# Altium project LimeSDR-X3_1v0.PrjPcb (part 11 of 19)

## Sheet 22_LMS2_TX_BB_DACs.SchDoc: LMS2 TX BB DACs
size A3; Organization: Lime Microsystems; Address1: Surrey Tech Centre; Address2: Guildford GU2 7YG; Address3: Surrey; Address4: United Kingdom; Revision: v1.0; SheetNumber: 22; SheetTotal: 31
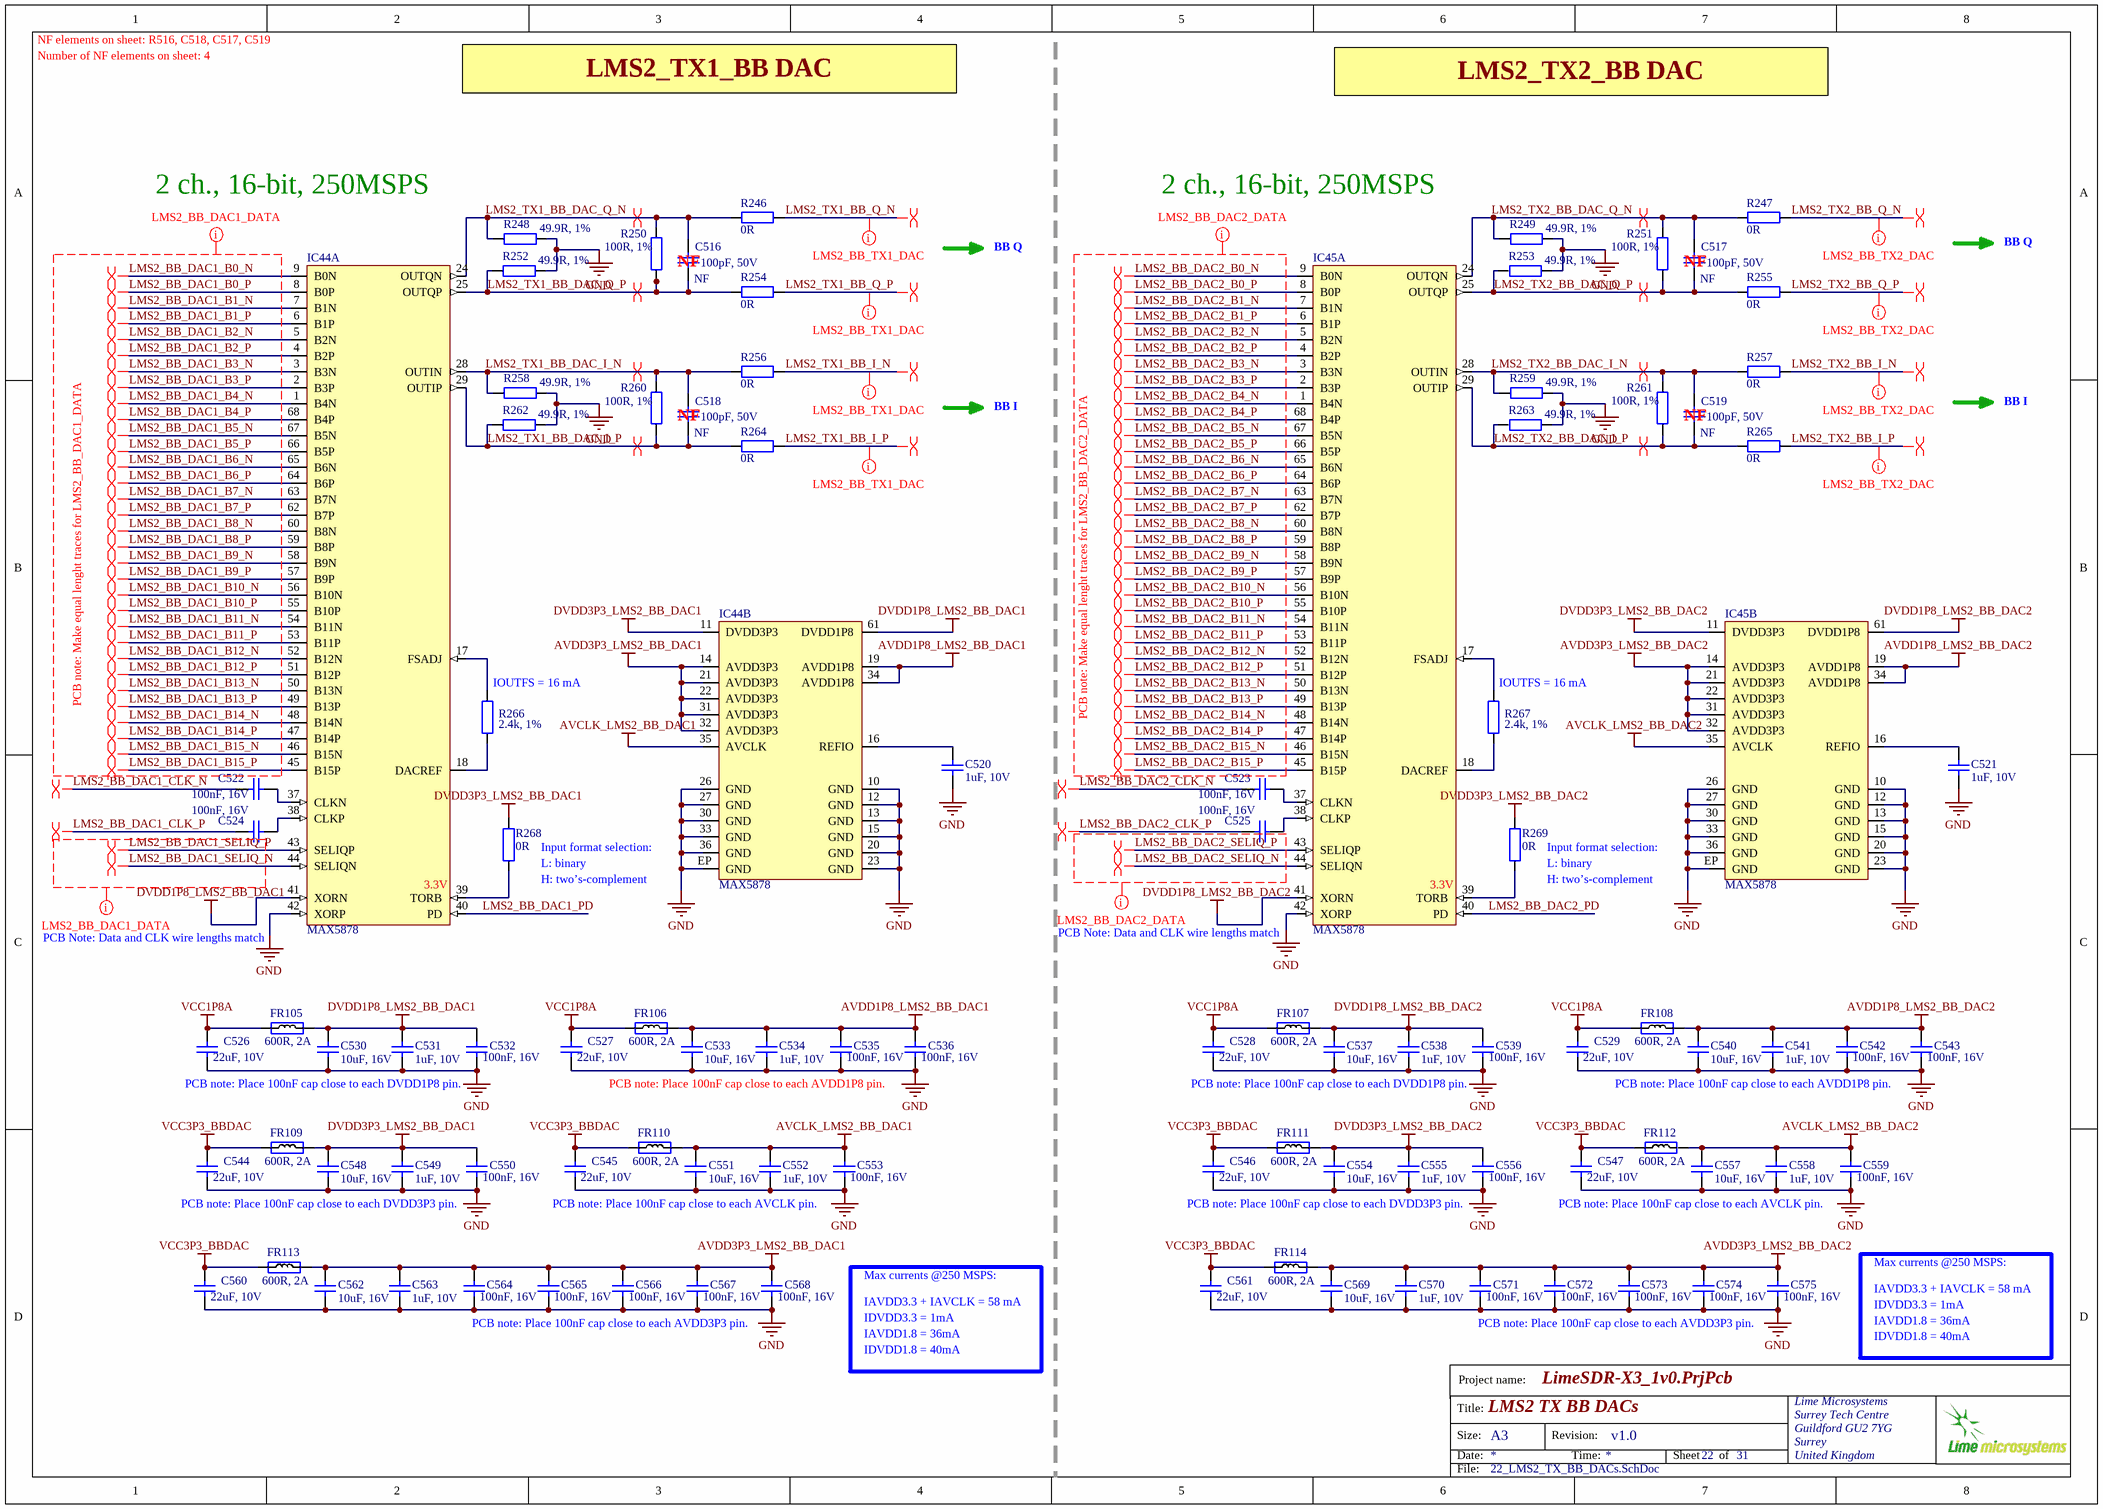
[diagram p21: 22_LMS2_TX_BB_DACs.SchDoc]

### Parts
C516  100pF, 50V  Assembly Info: NF  [CAP0402]
C517  100pF, 50V  Assembly Info: NF  [CAP0402]
C518  100pF, 50V  Assembly Info: NF  [CAP0402]
C519  100pF, 50V  Assembly Info: NF  [CAP0402]
C520  1uF, 10V  [CAP0402]
C521  1uF, 10V  [CAP0402]
C522  100nF, 16V  [CAP0402]
C523  100nF, 16V  [CAP0402]
C524  100nF, 16V  [CAP0402]
C525  100nF, 16V  [CAP0402]
C526  22uF, 10V  [CAP0603]
C527  22uF, 10V  [CAP0603]
C528  22uF, 10V  [CAP0603]
C529  22uF, 10V  [CAP0603]
C530  10uF, 16V  [CAP0603]
C531  1uF, 10V  [CAP0402]
C532  100nF, 16V  [CAP0402]
C533  10uF, 16V  [CAP0603]
C534  1uF, 10V  [CAP0402]
C535  100nF, 16V  [CAP0402]
C536  100nF, 16V  [CAP0402]
C537  10uF, 16V  [CAP0603]
C538  1uF, 10V  [CAP0402]
C539  100nF, 16V  [CAP0402]
C540  10uF, 16V  [CAP0603]
C541  1uF, 10V  [CAP0402]
C542  100nF, 16V  [CAP0402]
C543  100nF, 16V  [CAP0402]
C544  22uF, 10V  [CAP0603]
C545  22uF, 10V  [CAP0603]
C546  22uF, 10V  [CAP0603]
C547  22uF, 10V  [CAP0603]
C548  10uF, 16V  [CAP0603]
C549  1uF, 10V  [CAP0402]
C550  100nF, 16V  [CAP0402]
C551  10uF, 16V  [CAP0603]
C552  1uF, 10V  [CAP0402]
C553  100nF, 16V  [CAP0402]
C554  10uF, 16V  [CAP0603]
C555  1uF, 10V  [CAP0402]
C556  100nF, 16V  [CAP0402]
C557  10uF, 16V  [CAP0603]
C558  1uF, 10V  [CAP0402]
C559  100nF, 16V  [CAP0402]
C560  22uF, 10V  [CAP0603]
C561  22uF, 10V  [CAP0603]
C562  10uF, 16V  [CAP0603]
C563  1uF, 10V  [CAP0402]
C564  100nF, 16V  [CAP0402]
C565  100nF, 16V  [CAP0402]
C566  100nF, 16V  [CAP0402]
C567  100nF, 16V  [CAP0402]
C568  100nF, 16V  [CAP0402]
C569  10uF, 16V  [CAP0603]
C570  1uF, 10V  [CAP0402]
C571  100nF, 16V  [CAP0402]
C572  100nF, 16V  [CAP0402]
C573  100nF, 16V  [CAP0402]
C574  100nF, 16V  [CAP0402]
C575  100nF, 16V  [CAP0402]
FR105  600R, 2A  [RES0805]
FR106  600R, 2A  [RES0805]
FR107  600R, 2A  [RES0805]
FR108  600R, 2A  [RES0805]
FR109  600R, 2A  [RES0805]
FR110  600R, 2A  [RES0805]
FR111  600R, 2A  [RES0805]
FR112  600R, 2A  [RES0805]
FR113  600R, 2A  [RES0805]
FR114  600R, 2A  [RES0805]
IC44  MAX5878  [MAX5878_QFN68]  (parts A,B of 2)
IC45  MAX5878  [MAX5878_QFN68]  (parts A,B of 2)
R246  0R  [RES0402]
R247  0R  [RES0402]
R248  49.9R, 1%  [RES0402]
R249  49.9R, 1%  [RES0402]
R250  100R, 1%  [RES0402]
R251  100R, 1%  [RES0402]
R252  49.9R, 1%  [RES0402]
R253  49.9R, 1%  [RES0402]
R254  0R  [RES0402]
R255  0R  [RES0402]
R256  0R  [RES0402]
R257  0R  [RES0402]
R258  49.9R, 1%  [RES0402]
R259  49.9R, 1%  [RES0402]
R260  100R, 1%  [RES0402]
R261  100R, 1%  [RES0402]
R262  49.9R, 1%  [RES0402]
R263  49.9R, 1%  [RES0402]
R264  0R  [RES0402]
R265  0R  [RES0402]
R266  2.4k, 1%  [RES0402]
R267  2.4k, 1%  [RES0402]
R268  0R  [RES0402]
R269  0R  [RES0402]

### Nets
AVCLK_LMS2_BB_DAC1: C551.2 C552.2 C553.2 FR110.2 IC44.35(AVCLK)
AVCLK_LMS2_BB_DAC2: C557.2 C558.2 C559.2 FR112.2 IC45.35(AVCLK)
AVDD1P8_LMS2_BB_DAC1: C533.2 C534.2 C535.2 C536.2 FR106.2 IC44.19(AVDD1P8) IC44.34(AVDD1P8)
AVDD1P8_LMS2_BB_DAC2: C540.2 C541.2 C542.2 C543.2 FR108.2 IC45.19(AVDD1P8) IC45.34(AVDD1P8)
AVDD3P3_LMS2_BB_DAC1: C562.2 C563.2 C564.2 C565.2 C566.2 C567.2 C568.2 FR113.2 IC44.14(AVDD3P3) IC44.21(AVDD3P3) IC44.22(AVDD3P3) IC44.31(AVDD3P3) IC44.32(AVDD3P3)
AVDD3P3_LMS2_BB_DAC2: C569.2 C570.2 C571.2 C572.2 C573.2 C574.2 C575.2 FR114.2 IC45.14(AVDD3P3) IC45.21(AVDD3P3) IC45.22(AVDD3P3) IC45.31(AVDD3P3) IC45.32(AVDD3P3)
DVDD1P8_LMS2_BB_DAC1: C530.2 C531.2 C532.2 FR105.2 IC44.41(XORN) IC44.61(DVDD1P8)
DVDD1P8_LMS2_BB_DAC2: C537.2 C538.2 C539.2 FR107.2 IC45.41(XORN) IC45.61(DVDD1P8)
DVDD3P3_LMS2_BB_DAC1: C548.2 C549.2 C550.2 FR109.2 IC44.11(DVDD3P3) R268.2
DVDD3P3_LMS2_BB_DAC2: C554.2 C555.2 C556.2 FR111.2 IC45.11(DVDD3P3) R269.2
GND: C520.1 C521.1 C526.1 C527.1 C528.1 C529.1 C530.1 C531.1 C532.1 C533.1 C534.1 C535.1 C536.1 C537.1 C538.1 C539.1 C540.1 C541.1 C542.1 C543.1 C544.1 C545.1 C546.1 C547.1 C548.1 C549.1 C550.1 C551.1 C552.1 C553.1 C554.1 C555.1 C556.1 C557.1 C558.1 C559.1 C560.1 C561.1 C562.1 C563.1 C564.1 C565.1 C566.1 C567.1 C568.1 C569.1 C570.1 C571.1 C572.1 C573.1 C574.1 C575.1 IC44.10(GND) IC44.12(GND) IC44.13(GND) IC44.15(GND) IC44.20(GND) IC44.23(GND) IC44.26(GND) IC44.27(GND) IC44.30(GND) IC44.33(GND) IC44.36(GND) IC44.42(XORP) IC44.EP(GND) IC45.10(GND) IC45.12(GND) IC45.13(GND) IC45.15(GND) IC45.20(GND) IC45.23(GND) IC45.26(GND) IC45.27(GND) IC45.30(GND) IC45.33(GND) IC45.36(GND) IC45.42(XORP) IC45.EP(GND) R248.1 R249.1 R252.1 R253.1 R258.1 R259.1 R262.1 R263.1
VCC1P8A: C526.2 C527.2 C528.2 C529.2 FR105.1 FR106.1 FR107.1 FR108.1
VCC3P3_BBDAC: C544.2 C545.2 C546.2 C547.2 C560.2 C561.2 FR109.1 FR110.1 FR111.1 FR112.1 FR113.1 FR114.1
LMS2_BB_DAC1_B0_N: IC44.9(B0N)
LMS2_BB_DAC1_B0_P: IC44.8(B0P)
LMS2_BB_DAC1_B1_N: IC44.7(B1N)
LMS2_BB_DAC1_B1_P: IC44.6(B1P)
LMS2_BB_DAC1_B2_N: IC44.5(B2N)
LMS2_BB_DAC1_B2_P: IC44.4(B2P)
LMS2_BB_DAC1_B3_N: IC44.3(B3N)
LMS2_BB_DAC1_B3_P: IC44.2(B3P)
LMS2_BB_DAC1_B4_N: IC44.1(B4N)
LMS2_BB_DAC1_B4_P: IC44.68(B4P)
LMS2_BB_DAC1_B5_N: IC44.67(B5N)
LMS2_BB_DAC1_B5_P: IC44.66(B5P)
LMS2_BB_DAC1_B6_N: IC44.65(B6N)
LMS2_BB_DAC1_B6_P: IC44.64(B6P)
LMS2_BB_DAC1_B7_N: IC44.63(B7N)
LMS2_BB_DAC1_B7_P: IC44.62(B7P)
LMS2_BB_DAC1_B8_N: IC44.60(B8N)
LMS2_BB_DAC1_B8_P: IC44.59(B8P)
LMS2_BB_DAC1_B9_N: IC44.58(B9N)
LMS2_BB_DAC1_B9_P: IC44.57(B9P)
LMS2_BB_DAC1_B10_N: IC44.56(B10N)
LMS2_BB_DAC1_B10_P: IC44.55(B10P)
LMS2_BB_DAC1_B11_N: IC44.54(B11N)
LMS2_BB_DAC1_B11_P: IC44.53(B11P)
LMS2_BB_DAC1_B12_N: IC44.52(B12N)
LMS2_BB_DAC1_B12_P: IC44.51(B12P)
LMS2_BB_DAC1_B13_N: IC44.50(B13N)
LMS2_BB_DAC1_B13_P: IC44.49(B13P)
LMS2_BB_DAC1_B14_N: IC44.48(B14N)
LMS2_BB_DAC1_B14_P: IC44.47(B14P)
LMS2_BB_DAC1_B15_N: IC44.46(B15N)
LMS2_BB_DAC1_B15_P: IC44.45(B15P)
LMS2_BB_DAC1_CLK_N: C522.2
LMS2_BB_DAC1_CLK_P: C524.2
LMS2_BB_DAC1_PD: IC44.40(PD)
LMS2_BB_DAC1_SELIQ_N: IC44.44(SELIQN)
LMS2_BB_DAC1_SELIQ_P: IC44.43(SELIQP)
LMS2_BB_DAC2_B0_N: IC45.9(B0N)
LMS2_BB_DAC2_B0_P: IC45.8(B0P)
LMS2_BB_DAC2_B1_N: IC45.7(B1N)
LMS2_BB_DAC2_B1_P: IC45.6(B1P)
LMS2_BB_DAC2_B2_N: IC45.5(B2N)
LMS2_BB_DAC2_B2_P: IC45.4(B2P)
LMS2_BB_DAC2_B3_N: IC45.3(B3N)
LMS2_BB_DAC2_B3_P: IC45.2(B3P)
LMS2_BB_DAC2_B4_N: IC45.1(B4N)
LMS2_BB_DAC2_B4_P: IC45.68(B4P)
LMS2_BB_DAC2_B5_N: IC45.67(B5N)
LMS2_BB_DAC2_B5_P: IC45.66(B5P)
LMS2_BB_DAC2_B6_N: IC45.65(B6N)
LMS2_BB_DAC2_B6_P: IC45.64(B6P)
LMS2_BB_DAC2_B7_N: IC45.63(B7N)
LMS2_BB_DAC2_B7_P: IC45.62(B7P)
LMS2_BB_DAC2_B8_N: IC45.60(B8N)
LMS2_BB_DAC2_B8_P: IC45.59(B8P)
LMS2_BB_DAC2_B9_N: IC45.58(B9N)
LMS2_BB_DAC2_B9_P: IC45.57(B9P)
LMS2_BB_DAC2_B10_N: IC45.56(B10N)
LMS2_BB_DAC2_B10_P: IC45.55(B10P)
LMS2_BB_DAC2_B11_N: IC45.54(B11N)
LMS2_BB_DAC2_B11_P: IC45.53(B11P)
LMS2_BB_DAC2_B12_N: IC45.52(B12N)
LMS2_BB_DAC2_B12_P: IC45.51(B12P)
LMS2_BB_DAC2_B13_N: IC45.50(B13N)
LMS2_BB_DAC2_B13_P: IC45.49(B13P)
LMS2_BB_DAC2_B14_N: IC45.48(B14N)
LMS2_BB_DAC2_B14_P: IC45.47(B14P)
LMS2_BB_DAC2_B15_N: IC45.46(B15N)
LMS2_BB_DAC2_B15_P: IC45.45(B15P)
LMS2_BB_DAC2_CLK_N: C523.2
LMS2_BB_DAC2_CLK_P: C525.2
LMS2_BB_DAC2_PD: IC45.40(PD)
LMS2_BB_DAC2_SELIQ_N: IC45.44(SELIQN)
LMS2_BB_DAC2_SELIQ_P: IC45.43(SELIQP)
LMS2_TX1_BB_DAC_I_N: C518.1 IC44.28(OUTIN) R256.1 R258.2 R260.1
LMS2_TX1_BB_DAC_I_P: C518.2 IC44.29(OUTIP) R260.2 R262.2 R264.1
LMS2_TX1_BB_DAC_Q_N: C516.1 IC44.24(OUTQN) R246.1 R248.2 R250.1
LMS2_TX1_BB_DAC_Q_P: C516.2 IC44.25(OUTQP) R250.2 R252.2 R254.1
LMS2_TX1_BB_I_N: R256.2
LMS2_TX1_BB_I_P: R264.2
LMS2_TX1_BB_Q_N: R246.2
LMS2_TX1_BB_Q_P: R254.2
LMS2_TX2_BB_DAC_I_N: C519.1 IC45.28(OUTIN) R257.1 R259.2 R261.1
LMS2_TX2_BB_DAC_I_P: C519.2 IC45.29(OUTIP) R261.2 R263.2 R265.1
LMS2_TX2_BB_DAC_Q_N: C517.1 IC45.24(OUTQN) R247.1 R249.2 R251.1
LMS2_TX2_BB_DAC_Q_P: C517.2 IC45.25(OUTQP) R251.2 R253.2 R255.1
LMS2_TX2_BB_I_N: R257.2
LMS2_TX2_BB_I_P: R265.2
LMS2_TX2_BB_Q_N: R247.2
LMS2_TX2_BB_Q_P: R255.2
NetC520_2: C520.2 IC44.16(REFIO)
NetC521_2: C521.2 IC45.16(REFIO)
NetC522_1: C522.1 IC44.37(CLKN)
NetC523_1: C523.1 IC45.37(CLKN)
NetC524_1: C524.1 IC44.38(CLKP)
NetC525_1: C525.1 IC45.38(CLKP)
NetIC44_17: IC44.17(FSADJ) R266.2
NetIC44_18: IC44.18(DACREF) R266.1
NetIC44_39: IC44.39(TORB) R268.1
NetIC45_17: IC45.17(FSADJ) R267.2
NetIC45_18: IC45.18(DACREF) R267.1
NetIC45_39: IC45.39(TORB) R269.1

### Layout directives
differential pair: LMS2_BB_DAC1_B0_N, LMS2_BB_DAC1_B0_P, LMS2_BB_DAC1_B1_N, LMS2_BB_DAC1_B1_P, LMS2_BB_DAC1_B2_N, LMS2_BB_DAC1_B2_P, LMS2_BB_DAC1_B3_N, LMS2_BB_DAC1_B3_P, LMS2_BB_DAC1_B4_N, LMS2_BB_DAC1_B4_P, LMS2_BB_DAC1_B5_N, LMS2_BB_DAC1_B5_P, LMS2_BB_DAC1_B6_N, LMS2_BB_DAC1_B6_P, LMS2_BB_DAC1_B7_N, LMS2_BB_DAC1_B7_P, LMS2_BB_DAC1_B8_N, LMS2_BB_DAC1_B8_P, LMS2_BB_DAC1_B9_N, LMS2_BB_DAC1_B9_P, LMS2_BB_DAC1_B10_N, LMS2_BB_DAC1_B10_P, LMS2_BB_DAC1_B11_N, LMS2_BB_DAC1_B11_P, LMS2_BB_DAC1_B12_N, LMS2_BB_DAC1_B12_P, LMS2_BB_DAC1_B13_N, LMS2_BB_DAC1_B13_P, LMS2_BB_DAC1_B14_N, LMS2_BB_DAC1_B14_P, LMS2_BB_DAC1_B15_N, LMS2_BB_DAC1_B15_P, LMS2_BB_DAC1_CLK_N, LMS2_BB_DAC1_CLK_P, LMS2_BB_DAC1_SELIQ_N, LMS2_BB_DAC1_SELIQ_P, LMS2_BB_DAC2_B0_N, LMS2_BB_DAC2_B0_P, LMS2_BB_DAC2_B1_N, LMS2_BB_DAC2_B1_P, LMS2_BB_DAC2_B2_N, LMS2_BB_DAC2_B2_P, LMS2_BB_DAC2_B3_N, LMS2_BB_DAC2_B3_P, LMS2_BB_DAC2_B4_N, LMS2_BB_DAC2_B4_P, LMS2_BB_DAC2_B5_N, LMS2_BB_DAC2_B5_P, LMS2_BB_DAC2_B6_N, LMS2_BB_DAC2_B6_P, LMS2_BB_DAC2_B7_N, LMS2_BB_DAC2_B7_P, LMS2_BB_DAC2_B8_N, LMS2_BB_DAC2_B8_P, LMS2_BB_DAC2_B9_N, LMS2_BB_DAC2_B9_P, LMS2_BB_DAC2_B10_N, LMS2_BB_DAC2_B10_P, LMS2_BB_DAC2_B11_N, LMS2_BB_DAC2_B11_P, LMS2_BB_DAC2_B12_N, LMS2_BB_DAC2_B12_P, LMS2_BB_DAC2_B13_N, LMS2_BB_DAC2_B13_P, LMS2_BB_DAC2_B14_N, LMS2_BB_DAC2_B14_P, LMS2_BB_DAC2_B15_N, LMS2_BB_DAC2_B15_P, LMS2_BB_DAC2_CLK_N, LMS2_BB_DAC2_CLK_P, LMS2_BB_DAC2_SELIQ_N, LMS2_BB_DAC2_SELIQ_P, LMS2_TX1_BB_DAC_I_N, LMS2_TX1_BB_DAC_I_P, LMS2_TX1_BB_DAC_Q_N, LMS2_TX1_BB_DAC_Q_P, LMS2_TX1_BB_I_N, LMS2_TX1_BB_I_P, LMS2_TX1_BB_Q_N, LMS2_TX1_BB_Q_P, LMS2_TX2_BB_DAC_I_N, LMS2_TX2_BB_DAC_I_P, LMS2_TX2_BB_DAC_Q_N, LMS2_TX2_BB_DAC_Q_P, LMS2_TX2_BB_I_N, LMS2_TX2_BB_I_P, LMS2_TX2_BB_Q_N, LMS2_TX2_BB_Q_P
net class LMS2_BB_DAC1_DATA: LMS2_BB_DAC1_B0_N, LMS2_BB_DAC1_B0_P, LMS2_BB_DAC1_B1_N, LMS2_BB_DAC1_B1_P, LMS2_BB_DAC1_B2_N, LMS2_BB_DAC1_B2_P, LMS2_BB_DAC1_B3_N, LMS2_BB_DAC1_B3_P, LMS2_BB_DAC1_B4_N, LMS2_BB_DAC1_B4_P, LMS2_BB_DAC1_B5_N, LMS2_BB_DAC1_B5_P, LMS2_BB_DAC1_B6_N, LMS2_BB_DAC1_B6_P, LMS2_BB_DAC1_B7_N, LMS2_BB_DAC1_B7_P, LMS2_BB_DAC1_B8_N, LMS2_BB_DAC1_B8_P, LMS2_BB_DAC1_B9_N, LMS2_BB_DAC1_B9_P, LMS2_BB_DAC1_B10_N, LMS2_BB_DAC1_B10_P, LMS2_BB_DAC1_B11_N, LMS2_BB_DAC1_B11_P, LMS2_BB_DAC1_B12_N, LMS2_BB_DAC1_B12_P, LMS2_BB_DAC1_B13_N, LMS2_BB_DAC1_B13_P, LMS2_BB_DAC1_B14_N, LMS2_BB_DAC1_B14_P, LMS2_BB_DAC1_B15_N, LMS2_BB_DAC1_B15_P, LMS2_BB_DAC1_SELIQ_N, LMS2_BB_DAC1_SELIQ_P
net class LMS2_BB_DAC2_DATA: LMS2_BB_DAC2_B0_N, LMS2_BB_DAC2_B0_P, LMS2_BB_DAC2_B1_N, LMS2_BB_DAC2_B1_P, LMS2_BB_DAC2_B2_N, LMS2_BB_DAC2_B2_P, LMS2_BB_DAC2_B3_N, LMS2_BB_DAC2_B3_P, LMS2_BB_DAC2_B4_N, LMS2_BB_DAC2_B4_P, LMS2_BB_DAC2_B5_N, LMS2_BB_DAC2_B5_P, LMS2_BB_DAC2_B6_N, LMS2_BB_DAC2_B6_P, LMS2_BB_DAC2_B7_N, LMS2_BB_DAC2_B7_P, LMS2_BB_DAC2_B8_N, LMS2_BB_DAC2_B8_P, LMS2_BB_DAC2_B9_N, LMS2_BB_DAC2_B9_P, LMS2_BB_DAC2_B10_N, LMS2_BB_DAC2_B10_P, LMS2_BB_DAC2_B11_N, LMS2_BB_DAC2_B11_P, LMS2_BB_DAC2_B12_N, LMS2_BB_DAC2_B12_P, LMS2_BB_DAC2_B13_N, LMS2_BB_DAC2_B13_P, LMS2_BB_DAC2_B14_N, LMS2_BB_DAC2_B14_P, LMS2_BB_DAC2_B15_N, LMS2_BB_DAC2_B15_P, LMS2_BB_DAC2_SELIQ_N, LMS2_BB_DAC2_SELIQ_P
net class LMS2_BB_TX2_DAC: LMS2_TX2_BB_I_N, LMS2_TX2_BB_I_P, LMS2_TX2_BB_Q_N, LMS2_TX2_BB_Q_P
net class LMS2_BB_TX1_DAC: LMS2_TX1_BB_I_N, LMS2_TX1_BB_I_P, LMS2_TX1_BB_Q_N, LMS2_TX1_BB_Q_P

### Notes on the sheet
- NF elements on sheet: R516, C518, C517, C519
- Number of NF elements on sheet: 4
- LMS2_TX1_BB DAC
- LMS2_TX2_BB DAC
- (near R248) 2 ch., 16-bit, 250MSPS
- BB Q
- (near R249) 2 ch., 16-bit, 250MSPS
- (near C516) NF
- (near C517) NF
- (near C518) NF
- BB I
- (near C519) NF
- PCB note: Make equal lenght traces for LMS2_BB_DAC1_DATA
- (near R266) IOUTFS = 16 mA
- PCB note: Make equal lenght traces for LMS2_BB_DAC2_DATA
- (near R267) IOUTFS = 16 mA
- Input format selection:
- (near IC44) 3.3V
- (near R268) L: binary
- (near R268) H: two’s-complement
- (near IC45) 3.3V
- (near R269) L: binary
- (near R269) H: two’s-complement
- (near IC44) PCB Note: Data and CLK wire lengths match
- (near IC45) PCB Note: Data and CLK wire lengths match
- PCB note: Place 100nF cap close to each DVDD1P8 pin.
- PCB note: Place 100nF cap close to each AVDD1P8 pin.
- PCB note: Place 100nF cap close to each DVDD3P3 pin.
- PCB note: Place 100nF cap close to each AVCLK pin.
- PCB note: Place 100nF cap close to each AVDD3P3 pin.
- IAVDD3.3 + IAVCLK = 58 mA
- IDVDD3.3 = 1mA
- Max currents @250 MSPS:
- IAVDD1.8 = 36mA
- IDVDD1.8 = 40mA
- Project name:
- Title:
- Size:
- Date:
- A3
- Revision:
- Time:
- Sheet
- of
- File:

### Library data of the parts
C516-C519 = Cap_0402: Manufacturer Part Number 1: CC0402JRNPO9BN101; Manufacturer: Yageo; Part Description: 100pF ±5% 50V C0G, NP0 Ceramic Capacitor -55°C ~ 125°C Surface Mount, MLCC 0402 (1005 Metric) 0.039" L x 0.020" W (1.00mm x 0.50mm); Tolerance: ±5%; Temperature Coefficient: C0G, NP0; Value: 100pF, 50V; Capacitance: 100pF; Thickness (Max): 0.022" (0.55mm); Size / Dimension: 0.039" L x 0.020" W (1.00mm x 0.50mm); RoHS: RoHS Compliant; Ratings: -; Package / Case: 0402 (1005 Metric); Mounting Type: Surface Mount, MLCC; Height - Seated (Max): -; Features: -; Lead Spacing: -; Voltage - Rated: 50V; Operating Temperature: -55°C ~ 125°C; Packaging: Cut Tape (CT); Applications: General Purpose; Lead Style: -; Supplier 1: Digi-Key; Category: Capacitors; Supplier Part Number 1: 311-1024-1-ND
C520 C521 C531 C534 C538 C541 C549 C552 C555 C558 C563 C570 = Cap_0402: Manufacturer Part Number 1: C1005X5R1E105K050BC; Manufacturer: TDK; Part Description: 1µF ±10% 10V X5R Ceramic Capacitor -55°C ~ 85°C Surface Mount, MLCC 0402 (1005 Metric) 0.039" L x 0.020" W (1.00mm x 0.50mm); Voltage Rating: 10; Capacitance Tolerance: ± 10%; Product Range: TDK - C Series; Ceramic Capacitor Case: 0402 [1005 Metric]; Capacitance: 1; Dielectric Characteristic: X6; Value: 1uF, 10V; Supplier 1: Digi-Key; Supplier Part Number 1: 445-9066-1-ND; MSL: -; RoHS: YES
C522-C525 C532 C535 C536 C539 C542 C543 C550 C553 C556 C559 C564-C568 C571-C575 = Cap_0603: Part Description: 0.10µF ±10% 16V X7R Ceramic Capacitor -55°C ~ 125°C Surface Mount, MLCC 0402 (1005 Metric) 0.039" L x 0.020" W (1.00mm x 0.50mm); Manufacturer Part Number 1: GRM155R71C104KA88D; Brand: Murata Electronics; Tolerance: 10 %; Type: General Purpose MLCC; Capacitance: 0.1 uF; Temperature Coefficient / Code: +/- 15 %; Case Height: 0.5 mm; Case Length: 1 mm; Dielectric: X7R; Supplier 1: Mouser; Supplier Part Number 1: 81-GRM155R71C104KA88; Case Code - in: 0402; Manufacturer: Murata Electronics; Category: Multilayer Ceramic Capacitors MLCC - SMD/SMT; Voltage Rating DC: 16 V; Value: 100nF, 16V; Case Code - mm: 1005; Case Width: 0.5 mm; Maximum Operating Temperature: + 125 C; Minimum Operating Temperature: - 55 C; Minimum Order Quantity: 1; Operating Temperature Range: - 55 C to + 125 C; Package / Case: 0402 (1005 metric); Packaging: Reel; Product: General Type MLCCs; Product Category: Low & Medium Capacitance SMD Ceramic Chip Capacitors; Reeling: True; RoHS - Mouser: Y; RoHS: RoHS Compliant; Series: GRM; Standard Pack Qty: 10000; Termination Style: SMD/SMT
C526-C529 C544-C547 C560 C561 = Cap_0603: Manufacturer Part Number 1: C1608X5R1A226M080AC; Part Description: 22µF ±20% 10V Ceramic Capacitor X5R 0603 (1608 Metric); Manufacturer: TDK Corporation; Brand: TDK; Temperature Coefficient / Code: +/- 15 %; Tolerance: 20 %; Type: Multilayer Ceramic Chip Capacitor; Supplier 1: Mouser; Supplier Part Number 1: 810-C1608X5R1A226M; Package / Case: 0603 (1608 metric); Category: Multilayer Ceramic Capacitors MLCC - SMD/SMT; Capacitance: 22 uF; Operating Temperature Range: - 55 C to + 85 C; Case Code - in: 0603; Voltage Rating DC: 10 V; Case Code - mm: 1608; Value: 22uF, 10V
C530 C533 C537 C540 C548 C551 C554 C557 C562 C569 = Cap_0603: Manufacturer: Yageo; Manufacturer Part Number 1: GRM188R61C106MA73D; Part Description: 10µF ±20% 16V Ceramic Capacitor X5R 0603 (1608 Metric); Temperature Coefficient: X5R; Capacitance: 10µF; Tolerance: ±20%; Value: 10uF, 16V; Supplier 1: Digi-Key; Supplier Part Number 1: 490-7201-2-ND; Category: Capacitors; Ratings: -; Features: -; Lead Style: -; Package / Case: 0603 (1608 Metric); Lead Spacing: -; Applications: General Purpose; Voltage - Rated: 16V; Operating Temperature: -55°C ~ 85°C; Thickness (Max): 0.039" (1.00mm); Mounting Type: Surface Mount, MLCC; RoHS: RoHS Compliant; Size / Dimension: 0.063" L x 0.031" W (1.60mm x 0.80mm); Packaging: Tape & Reel (TR); Height - Seated (Max): -
FR105-FR114 = Ferrite: Manufacturer Part Number 1: MPZ2012S601AT000; Manufacturer: TDK Corporation; Part Description: FERRITE BEAD 600 OHM 0805 1LN; Filter Type: Differential Mode - Single; Impedance @ Frequency: 600 Ohm @ 100MHz; DC Resistance (DCR): 100 mOhm Max; Supplier 1: Digi-Key; Supplier Part Number 1: 445-2206-2-ND; Mounting Type: Surface Mount; RoHS: RoHS Compliant; Height (Max): 0.041" (1.05mm); Packaging: Tape & Reel (TR); Category: Filters; Current Rating: 2A; Package / Case: 0805 (2012 Metric); Size / Dimension: 0.079" L x 0.049" W (2.00mm x 1.25mm); Value: 600R, 2A
IC44 IC45 = MAX5878EGK: Part Description: 16 Bit Digital to Analog Converter 2 68-QFN-EP (10x10); Manufacturer: Maxim; Manufacturer Part Number 1: MAX5878EGK+D; Max Power Dissipation: 331mW; Number of DAC Channels: 2; Max Supply Voltage: 3.465V; Min Supply Voltage: 3.135V; Interface: Parallel,LVDS; Settling Time: 14ns; Number of Bits: 16; Sampling Rate: 250000000S/s; Resolution: 16b; Supply Type: Analog,Digital; Conversion Rate: 250MS/s; Integral Nonlinearity (INL): 3LSB; Supplier 1: Digi-Key; Supplier Part Number 1: MAX5878EGK+D-ND; Stock 1: 52; Pricing 1: 1=23,84000, 10=21,99000, 25=21,00200, 100=20,44800 (USD); RoHS: Yes; Mount: Surface Mount; Case/Package: QFN; Number of Pins: 68; Min Operating Temperature: -40°C; Max Operating Temperature: 85°C; Packaging: Rail/Tube; Package Quantity: 30; Number of Converters: 2; Radiation Hardening: No; REACH SVHC: Unknown; ComponentLink1URL: https://datasheet.ciiva.com/1399/max5878-1399152.pdf?src-supplier=Digi-Key; ComponentLink1Description: https://datasheet.ciiva.com/1399/max5878-1399152.pdf?src-supplier=Digi-Key; ComponentLink2URL: https://datasheet.ciiva.com/16604/max5878-16604848.pdf?src-supplier=Avnet+Europe; ComponentLink2Description: https://datasheet.ciiva.com/16604/max5878-16604848.pdf?src-supplier=Avnet+Europe; ComponentLink3URL: https://datasheet.ciiva.com/12285/max5878-106739-12285938.pdf?src-supplier=Mouser; ComponentLink3Description: https://datasheet.ciiva.com/12285/max5878-106739-12285938.pdf?src-supplier=Mouser; ComponentLink4URL: https://datasheet.ciiva.com/26805/max5878egk-d-26805730.pdf?src-supplier=IIIC; ComponentLink4Description: https://datasheet.ciiva.com/26805/max5878egk-d-26805730.pdf?src-supplier=IIIC; ComponentLink5URL: https://datasheet.ciiva.com/14250/max5878-14250858.pdf?src-supplier=Avnet; ComponentLink5Description: https://datasheet.ciiva.com/14250/max5878-14250858.pdf?src-supplier=Avnet
R246 R247 R254-R257 R264 R265 R268 R269 = Res_0402: Manufacturer Part Number 1: RC0402JR-070RL; Manufacturer: Yageo; Part Description: RES SMD 0.0OHM JUMPER 1/16W 0402; Resistance (Ohms): 0.0; Tolerance: Jumper; Power (Watts): 0.063W, 1/16W; Value: 0R; Supplier 1: Digi-Key; Supplier Part Number 1: 311-0.0JRTR-ND; Category: Resistors; Temperature Coefficient: -; Features: Moisture Resistant; Supplier Device Package: 0402; Height: 0.016" (0.40mm); Package / Case: 0402 (1005 Metric); Operating Temperature: -55°C ~ 155°C; Size / Dimension: 0.039" L x 0.020" W (1.00mm x 0.50mm); Composition: Thick Film; Packaging: Tape & Reel (TR); Number of Terminations: 2; RoHS: RoHS Compliant
R248 R249 R252 R253 R258 R259 R262 R263 = Res_0402: Manufacturer: Samsung Electro-Mechanics America, Inc.; Part Description: RES SMD 49.9 OHM 1% 1/16W 0402; Manufacturer Part Number 1: RC1005F49R9CS; Temperature Coefficient: ±100ppm/°C; Resistance (Ohms): 49.9; Power (Watts): 0.063W, 1/16W; Number of Terminations: 2; Size / Dimension: 0.039" L x 0.020" W (1.00mm x 0.50mm); Supplier Device Package: 0402 (1005 Metric); RoHS: RoHS Compliant; Supplier Part Number 1: 1276-3469-6-ND; Features: -; Packaging: Digi-Reel®; Tolerance: ±1%; Height: 0.016" (0.40mm); Category: Resistors; Composition: Thick Film; Package / Case: 0402 (1005 Metric); Supplier 1: Digi-Key; Operating Temperature: -55°C ~ 155°C; Value: 49.9R, 1%
R250 R251 R260 R261 = Res_0402: Manufacturer Part Number 1: RMCF0402FT100R; Manufacturer: Stackpole Electronics Inc.; Part Description: RES SMD 100 OHM 1% 1/16W 0402; Power (Watts): 0.063W, 1/16W; Temperature Coefficient: ±100ppm/°C; Resistance (Ohms): 100; Value: 100R, 1%; Supplier 1: Digi-Key; Supplier Part Number 1: RMCF0402FT100RDKR-ND; Packaging: Digi-Reel®; Composition: Thick Film; Number of Terminations: 2; Package / Case: 0402 (1005 Metric); RoHS: RoHS Compliant; Category: Resistors; Size / Dimension: 0.039" L x 0.020" W (1.00mm x 0.50mm); Tolerance: ±1%; Supplier Device Package: 0402; Features: -; Height: 0.016" (0.40mm); Operating Temperature: -55°C ~ 155°C
R266 R267 = Res_0402: Manufacturer Part Number 1: RC0402FR-072K4L; Manufacturer: Yageo; Part Description: 2.4 kOhms ±1% 0.063W, 1/16W Chip Resistor 0402 (1005 Metric) Moisture Resistant Thick Film; Temperature Coefficient: ±100ppm/°C; Power (Watts): 0.063W, 1/16W; Value: 2.4k, 1%; Package / Case: 0402 (1005 Metric); RoHS: RoHS Compliant; Supplier Part Number 1: 311-2.40KLRCT-ND; Resistance (Ohms): 2.4k; Size / Dimension: 0.039" L x 0.020" W (1.00mm x 0.50mm); Category: Resistors; Part Status: Active; Features: Moisture Resistant; Supplier Device Package: 0402; Failure Rate: -; Tolerance: ±1%; Composition: Thick Film; Packaging: Cut Tape (CT); Operating Temperature: -55°C ~ 155°C; Height - Seated (Max): 0.016" (0.40mm); Supplier 1: Digi-Key

## Sheet 23_LMS2_RX1_BB_ADC.SchDoc: LMS2 RX1 BB ADC
size A3; Organization: Lime Microsystems; Address1: Surrey Tech Centre; Address2: Guildford GU2 7YG; Address3: Surrey; Address4: United Kingdom; Revision: v1.0; SheetNumber: 23; SheetTotal: 31
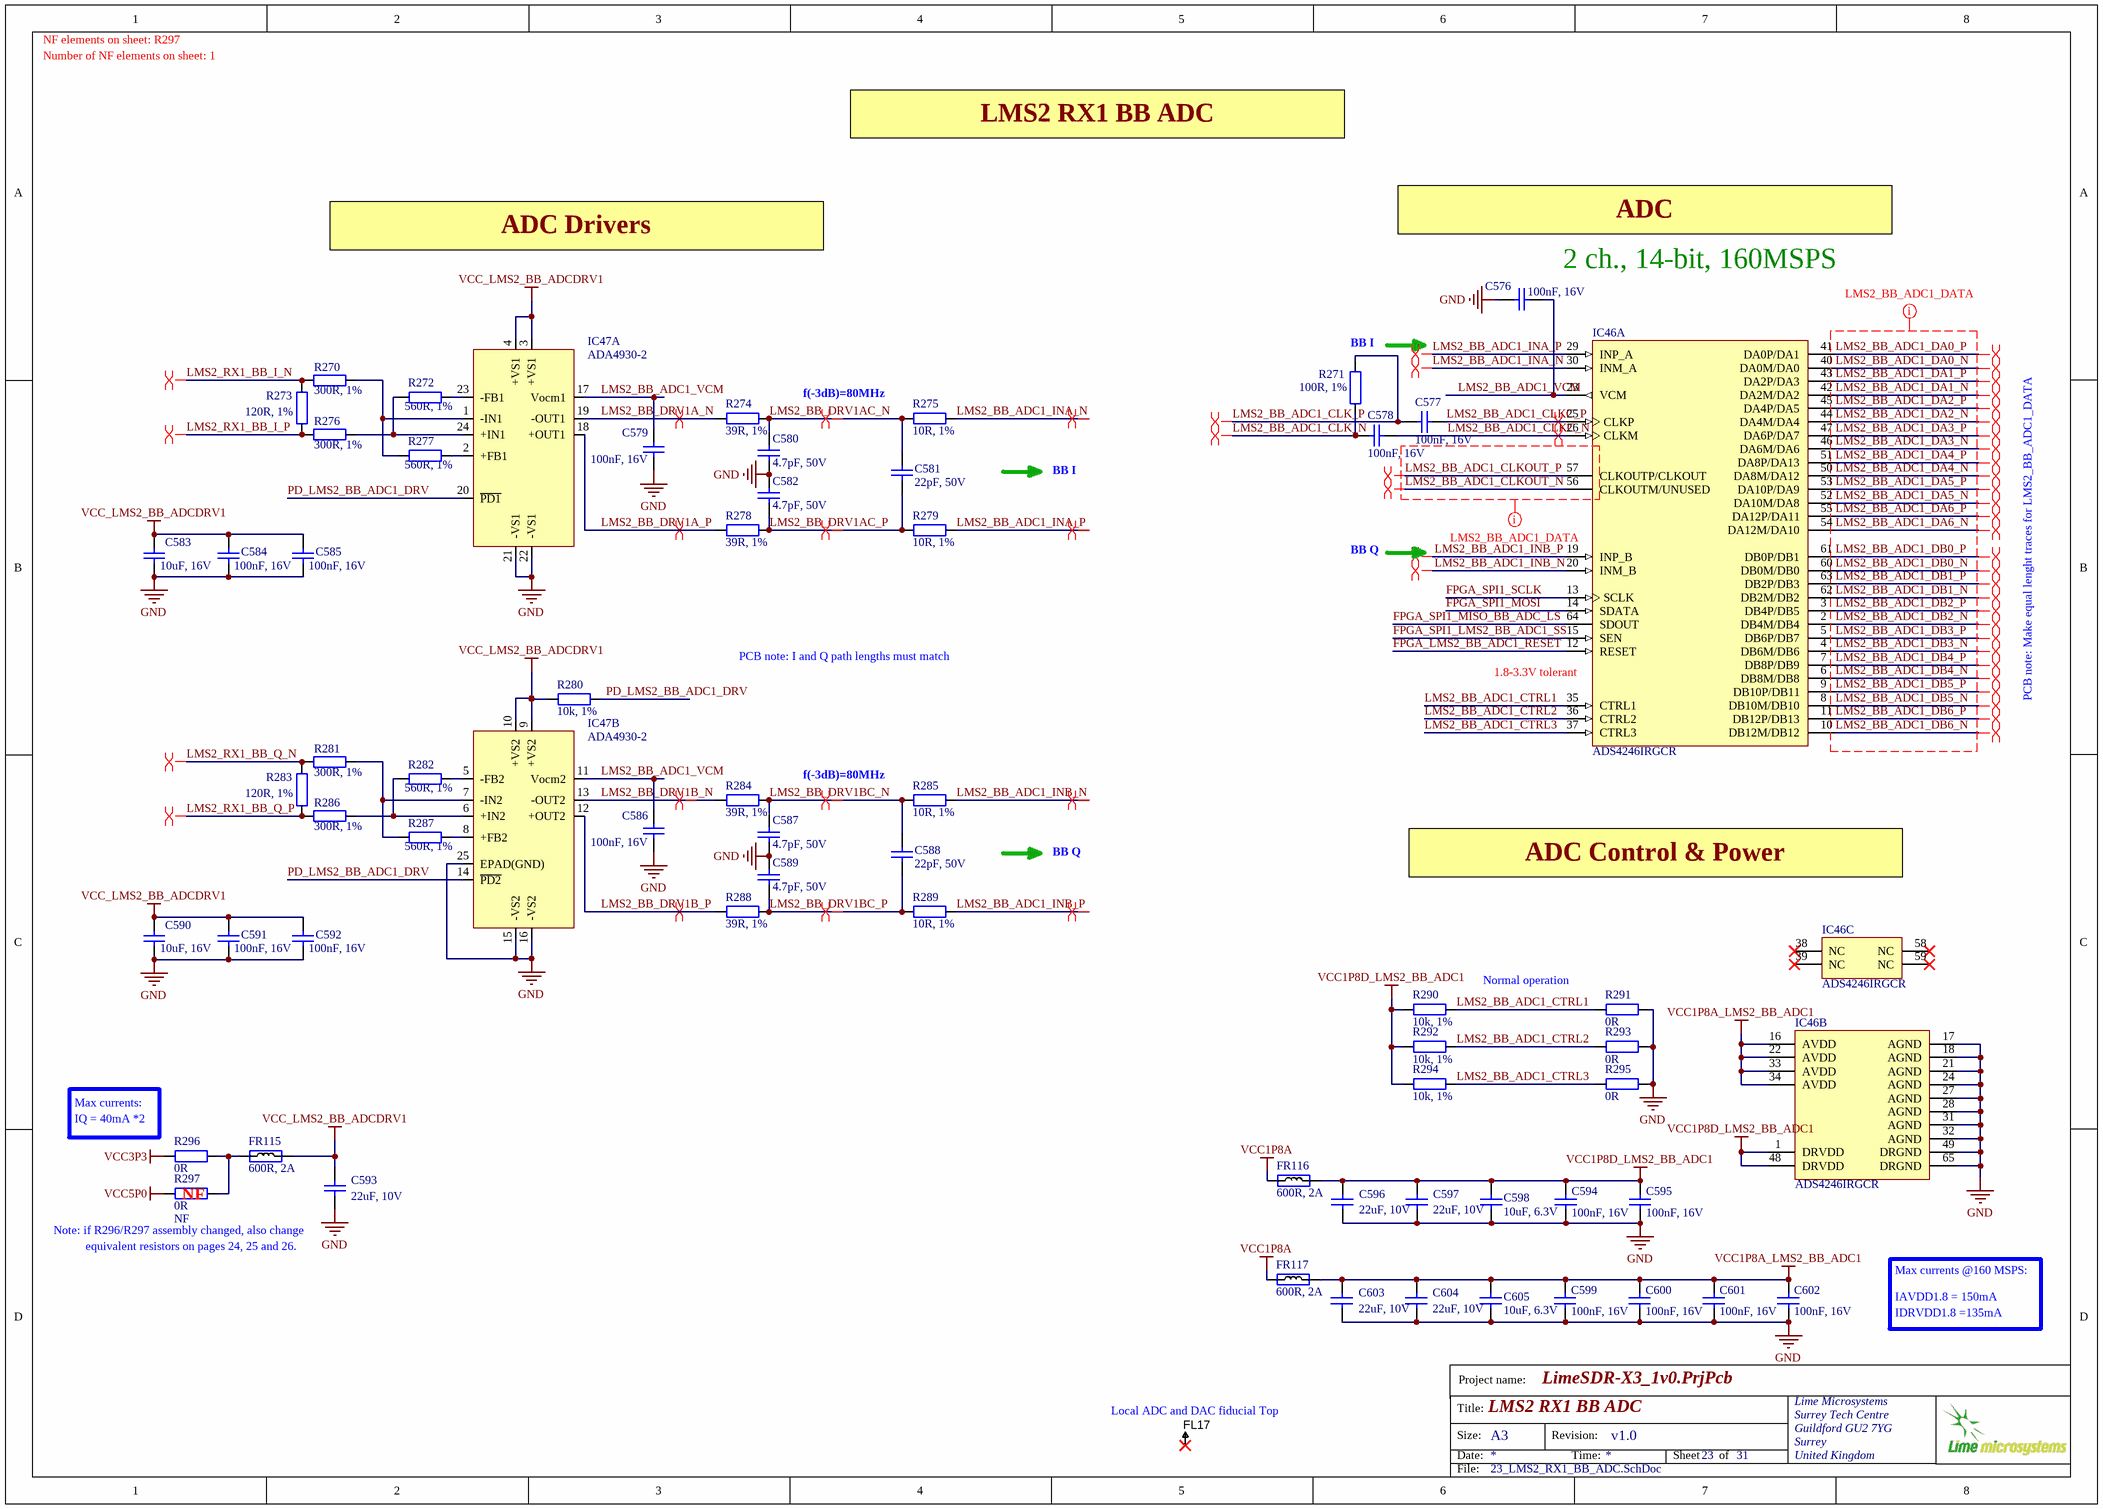
[diagram p22: 23_LMS2_RX1_BB_ADC.SchDoc]

### Parts
C576  100nF, 16V  [CAP0402]
C577  100nF, 16V  [CAP0402]
C578  100nF, 16V  [CAP0402]
C579  100nF, 16V  [CAP0402]
C580  4.7pF, 50V  [CAP0402]
C581  22pF, 50V  [CAP0402]
C582  4.7pF, 50V  [CAP0402]
C583  10uF, 16V  [CAP0603]
C584  100nF, 16V  [CAP0402]
C585  100nF, 16V  [CAP0402]
C586  100nF, 16V  [CAP0402]
C587  4.7pF, 50V  [CAP0402]
C588  22pF, 50V  [CAP0402]
C589  4.7pF, 50V  [CAP0402]
C590  10uF, 16V  [CAP0603]
C591  100nF, 16V  [CAP0402]
C592  100nF, 16V  [CAP0402]
C593  22uF, 10V  [CAP0603]
C594  100nF, 16V  [CAP0402]
C595  100nF, 16V  [CAP0402]
C596  22uF, 10V  [CAP0603]
C597  22uF, 10V  [CAP0603]
C598  10uF, 6.3V  [CAP0603]
C599  100nF, 16V  [CAP0402]
C600  100nF, 16V  [CAP0402]
C601  100nF, 16V  [CAP0402]
C602  100nF, 16V  [CAP0402]
C603  22uF, 10V  [CAP0603]
C604  22uF, 10V  [CAP0603]
C605  10uF, 6.3V  [CAP0603]
FL17  Fiducial  [Fiducial_local]  (value not drawn)
FR115  600R, 2A  [RES0805]
FR116  600R, 2A  [RES0805]
FR117  600R, 2A  [RES0805]
IC46  ADS4246IRGCR  [TI-RGC64-7400X7400TP_V]  (parts A,B,C of 3)
IC47  ADA4930-2  [ADA4930-2_LFCSP-24]  (parts A,B of 2)
R270  300R, 1%  [RES0402]
R271  100R, 1%  [RES0402]
R272  560R, 1%  [RES0402]
R273  120R, 1%  [RES0402]
R274  39R, 1%  [RES0402]
R275  10R, 1%  [RES0402]
R276  300R, 1%  [RES0402]
R277  560R, 1%  [RES0402]
R278  39R, 1%  [RES0402]
R279  10R, 1%  [RES0402]
R280  10k, 1%  [RES0402]
R281  300R, 1%  [RES0402]
R282  560R, 1%  [RES0402]
R283  120R, 1%  [RES0402]
R284  39R, 1%  [RES0402]
R285  10R, 1%  [RES0402]
R286  300R, 1%  [RES0402]
R287  560R, 1%  [RES0402]
R288  39R, 1%  [RES0402]
R289  10R, 1%  [RES0402]
R290  10k, 1%  [RES0402]
R291  0R  [RES0402]
R292  10k, 1%  [RES0402]
R293  0R  [RES0402]
R294  10k, 1%  [RES0402]
R295  0R  [RES0402]
R296  0R  [RES0402]
R297  0R  Assembly Info: NF  [RES0402]

### Nets
GND: C576.1 C579.2 C580.2 C582.1 C583.1 C584.2 C585.2 C586.2 C587.2 C589.1 C590.1 C591.2 C592.2 C593.1 C594.1 C595.1 C596.1 C597.1 C598.2 C599.1 C600.1 C601.1 C602.1 C603.1 C604.1 C605.2 IC46.17(AGND) IC46.18(AGND) IC46.21(AGND) IC46.24(AGND) IC46.27(AGND) IC46.28(AGND) IC46.31(AGND) IC46.32(AGND) IC46.49(DRGND) IC46.65(DRGND) IC47.15(-VS2) IC47.16(-VS2) IC47.21(-VS1) IC47.22(-VS1) IC47.25(EPAD(GND)) R291.1 R293.1 R295.1
VCC1P8A: FR116.1 FR117.1
VCC1P8A_LMS2_BB_ADC1: C599.2 C600.2 C601.2 C602.2 C603.2 C604.2 C605.1 FR117.2 IC46.16(AVDD) IC46.22(AVDD) IC46.33(AVDD) IC46.34(AVDD)
VCC1P8D_LMS2_BB_ADC1: C594.2 C595.2 C596.2 C597.2 C598.1 FR116.2 IC46.1(DRVDD) IC46.48(DRVDD) R290.2 R292.2 R294.2
VCC3P3: R296.2
VCC5P0: R297.2
VCC_LMS2_BB_ADCDRV1: C583.2 C584.1 C585.1 C590.2 C591.1 C592.1 C593.2 FR115.2 IC47.3(+VS1) IC47.4(+VS1) IC47.9(+VS2) IC47.10(+VS2) R280.2
FPGA_LMS2_BB_ADC1_RESET: IC46.12(RESET)
FPGA_SPI1_LMS2_BB_ADC1_SS: IC46.15(SEN)
FPGA_SPI1_MISO_BB_ADC_LS: IC46.64(SDOUT)
FPGA_SPI1_MOSI: IC46.14(SDATA)
FPGA_SPI1_SCLK: IC46.13(SCLK)
LMS2_BB_ADC1_CLK_N: C578.2 R271.1
LMS2_BB_ADC1_CLK_P: C577.2 R271.2
LMS2_BB_ADC1_CLKC_N: C578.1 IC46.26(CLKM)
LMS2_BB_ADC1_CLKC_P: C577.1 IC46.25(CLKP)
LMS2_BB_ADC1_CLKOUT_N: IC46.56(CLKOUTM/UNUSED)
LMS2_BB_ADC1_CLKOUT_P: IC46.57(CLKOUTP/CLKOUT)
LMS2_BB_ADC1_CTRL1: IC46.35(CTRL1) R290.1 R291.2
LMS2_BB_ADC1_CTRL2: IC46.36(CTRL2) R292.1 R293.2
LMS2_BB_ADC1_CTRL3: IC46.37(CTRL3) R294.1 R295.2
LMS2_BB_ADC1_DA0_N: IC46.40(DA0M/DA0)
LMS2_BB_ADC1_DA0_P: IC46.41(DA0P/DA1)
LMS2_BB_ADC1_DA1_N: IC46.42(DA2M/DA2)
LMS2_BB_ADC1_DA1_P: IC46.43(DA2P/DA3)
LMS2_BB_ADC1_DA2_N: IC46.44(DA4M/DA4)
LMS2_BB_ADC1_DA2_P: IC46.45(DA4P/DA5)
LMS2_BB_ADC1_DA3_N: IC46.46(DA6M/DA6)
LMS2_BB_ADC1_DA3_P: IC46.47(DA6P/DA7)
LMS2_BB_ADC1_DA4_N: IC46.50(DA8M/DA12)
LMS2_BB_ADC1_DA4_P: IC46.51(DA8P/DA13)
LMS2_BB_ADC1_DA5_N: IC46.52(DA10M/DA8)
LMS2_BB_ADC1_DA5_P: IC46.53(DA10P/DA9)
LMS2_BB_ADC1_DA6_N: IC46.54(DA12M/DA10)
LMS2_BB_ADC1_DA6_P: IC46.55(DA12P/DA11)
LMS2_BB_ADC1_DB0_N: IC46.60(DB0M/DB0)
LMS2_BB_ADC1_DB0_P: IC46.61(DB0P/DB1)
LMS2_BB_ADC1_DB1_N: IC46.62(DB2M/DB2)
LMS2_BB_ADC1_DB1_P: IC46.63(DB2P/DB3)
LMS2_BB_ADC1_DB2_N: IC46.2(DB4M/DB4)
LMS2_BB_ADC1_DB2_P: IC46.3(DB4P/DB5)
LMS2_BB_ADC1_DB3_N: IC46.4(DB6M/DB6)
LMS2_BB_ADC1_DB3_P: IC46.5(DB6P/DB7)
LMS2_BB_ADC1_DB4_N: IC46.6(DB8M/DB8)
LMS2_BB_ADC1_DB4_P: IC46.7(DB8P/DB9)
LMS2_BB_ADC1_DB5_N: IC46.8(DB10M/DB10)
LMS2_BB_ADC1_DB5_P: IC46.9(DB10P/DB11)
LMS2_BB_ADC1_DB6_N: IC46.10(DB12M/DB12)
LMS2_BB_ADC1_DB6_P: IC46.11(DB12P/DB13)
LMS2_BB_ADC1_INA_N: IC46.30(INM_A) R275.1
LMS2_BB_ADC1_INA_P: IC46.29(INP_A) R279.1
LMS2_BB_ADC1_INB_N: IC46.20(INM_B) R285.1
LMS2_BB_ADC1_INB_P: IC46.19(INP_B) R289.1
LMS2_BB_ADC1_VCM: C576.2 C579.1 C586.1 IC46.23(VCM) IC47.11(Vocm2) IC47.17(Vocm1)
LMS2_BB_DRV1A_N: IC47.19(-OUT1) R274.2
LMS2_BB_DRV1A_P: IC47.18(+OUT1) R278.2
LMS2_BB_DRV1AC_N: C580.1 C581.1 R274.1 R275.2
LMS2_BB_DRV1AC_P: C581.2 C582.2 R278.1 R279.2
LMS2_BB_DRV1B_N: IC47.13(-OUT2) R284.2
LMS2_BB_DRV1B_P: IC47.12(+OUT2) R288.2
LMS2_BB_DRV1BC_N: C587.1 C588.1 R284.1 R285.2
LMS2_BB_DRV1BC_P: C588.2 C589.2 R288.1 R289.2
LMS2_RX1_BB_I_N: R270.2 R273.2
LMS2_RX1_BB_I_P: R273.1 R276.2
LMS2_RX1_BB_Q_N: R281.2 R283.2
LMS2_RX1_BB_Q_P: R283.1 R286.2
PD_LMS2_BB_ADC1_DRV: IC47.14(~{PD2}) IC47.20(~{PD1}) R280.1
NetFR115_1: FR115.1 R296.1 R297.1
NetIC47_1: IC47.1(-IN1) R270.1 R277.2
NetIC47_2: IC47.2(+FB1) R277.1
NetIC47_5: IC47.5(-FB2) R282.1
NetIC47_6: IC47.6(+IN2) R282.2 R286.1
NetIC47_7: IC47.7(-IN2) R281.1 R287.2
NetIC47_8: IC47.8(+FB2) R287.1
NetIC47_23: IC47.23(-FB1) R272.1
NetIC47_24: IC47.24(+IN1) R272.2 R276.1

Not connected (* = marked no-connect by the designer): FL17 1*; IC46 38(NC)* 39(NC)* 58(NC)* 59(NC)*

### Layout directives
net class LMS2_BB_ADC1_DATA: LMS2_BB_ADC1_CLKOUT_N, LMS2_BB_ADC1_CLKOUT_P, LMS2_BB_ADC1_DA0_N, LMS2_BB_ADC1_DA0_P, LMS2_BB_ADC1_DA1_N, LMS2_BB_ADC1_DA1_P, LMS2_BB_ADC1_DA2_N, LMS2_BB_ADC1_DA2_P, LMS2_BB_ADC1_DA3_N, LMS2_BB_ADC1_DA3_P, LMS2_BB_ADC1_DA4_N, LMS2_BB_ADC1_DA4_P, LMS2_BB_ADC1_DA5_N, LMS2_BB_ADC1_DA5_P, LMS2_BB_ADC1_DA6_N, LMS2_BB_ADC1_DA6_P, LMS2_BB_ADC1_DB0_N, LMS2_BB_ADC1_DB0_P, LMS2_BB_ADC1_DB1_N, LMS2_BB_ADC1_DB1_P, LMS2_BB_ADC1_DB2_N, LMS2_BB_ADC1_DB2_P, LMS2_BB_ADC1_DB3_N, LMS2_BB_ADC1_DB3_P, LMS2_BB_ADC1_DB4_N, LMS2_BB_ADC1_DB4_P, LMS2_BB_ADC1_DB5_N, LMS2_BB_ADC1_DB5_P, LMS2_BB_ADC1_DB6_N, LMS2_BB_ADC1_DB6_P
differential pair: LMS2_BB_ADC1_CLK_N, LMS2_BB_ADC1_CLK_P, LMS2_BB_ADC1_CLKC_N, LMS2_BB_ADC1_CLKC_P, LMS2_BB_ADC1_CLKOUT_N, LMS2_BB_ADC1_CLKOUT_P, LMS2_BB_ADC1_DA0_N, LMS2_BB_ADC1_DA0_P, LMS2_BB_ADC1_DA1_N, LMS2_BB_ADC1_DA1_P, LMS2_BB_ADC1_DA2_N, LMS2_BB_ADC1_DA2_P, LMS2_BB_ADC1_DA3_N, LMS2_BB_ADC1_DA3_P, LMS2_BB_ADC1_DA4_N, LMS2_BB_ADC1_DA4_P, LMS2_BB_ADC1_DA5_N, LMS2_BB_ADC1_DA5_P, LMS2_BB_ADC1_DA6_N, LMS2_BB_ADC1_DA6_P, LMS2_BB_ADC1_DB0_N, LMS2_BB_ADC1_DB0_P, LMS2_BB_ADC1_DB1_N, LMS2_BB_ADC1_DB1_P, LMS2_BB_ADC1_DB2_N, LMS2_BB_ADC1_DB2_P, LMS2_BB_ADC1_DB3_N, LMS2_BB_ADC1_DB3_P, LMS2_BB_ADC1_DB4_N, LMS2_BB_ADC1_DB4_P, LMS2_BB_ADC1_DB5_N, LMS2_BB_ADC1_DB5_P, LMS2_BB_ADC1_DB6_N, LMS2_BB_ADC1_DB6_P, LMS2_BB_ADC1_INA_N, LMS2_BB_ADC1_INA_P, LMS2_BB_ADC1_INB_N, LMS2_BB_ADC1_INB_P, LMS2_BB_DRV1A_N, LMS2_BB_DRV1A_P, LMS2_BB_DRV1AC_N, LMS2_BB_DRV1AC_P, LMS2_BB_DRV1B_N, LMS2_BB_DRV1B_P, LMS2_BB_DRV1BC_N, LMS2_BB_DRV1BC_P, LMS2_RX1_BB_I_N, LMS2_RX1_BB_I_P, LMS2_RX1_BB_Q_N, LMS2_RX1_BB_Q_P

### Notes on the sheet
- NF elements on sheet: R297
- Number of NF elements on sheet: 1
- LMS2 RX1 BB ADC
- ADC Drivers
- ADC
- (near C576) 2 ch., 14-bit, 160MSPS
- (near R271) BB I
- f(-3dB)=80MHz
- BB I
- BB Q
- PCB note: I and Q path lengths must match
- (near IC46) 1.8-3.3V tolerant
- PCB note: Make equal lenght traces for LMS2_BB_ADC1_DATA
- ADC Control & Power
- Normal operation
- (near R296) IQ = 40mA *2
- (near R296) Max currents:
- Note: if R296/R297 assembly changed, also change
- equivalent resistors on pages 24, 25 and 26.
- (near R297) NF
- IAVDD1.8 = 150mA
- IDRVDD1.8 =135mA
- Max currents @160 MSPS:
- (near FL17) Local ADC and DAC fiducial Top
- Project name:
- Title:
- Size:
- Date:
- A3
- Revision:
- Time:
- Sheet
- of
- File:

### Library data of the parts
C576-C579 C586 C594 C595 C599-C602 = Cap_0603: as C522-C525 on sheet 22_LMS2_TX_BB_DACs; Supplier 1: Mouser; Supplier Part Number 1: 81-GRM155R71C104KA88; Case Code - in: 0402; Manufacturer: Murata Electronics; Category: Multilayer Ceramic Capacitors MLCC - SMD/SMT; Voltage Rating DC: 16 V; Value: 100nF, 16V; Case Code - mm: 1005; Case Width: 0.5 mm; Maximum Operating Temperature: + 125 C; Minimum Operating Temperature: - 55 C; Minimum Order Quantity: 1; Operating Temperature Range: - 55 C to + 125 C; Package / Case: 0402 (1005 metric); Packaging: Reel; Product: General Type MLCCs; Product Category: Low & Medium Capacitance SMD Ceramic Chip Capacitors; Reeling: True; RoHS - Mouser: Y; RoHS: RoHS Compliant; Series: GRM; Standard Pack Qty: 10000; Termination Style: SMD/SMT
C580 C582 C587 C589 = Cap_0402: Manufacturer: MURATA; Manufacturer Part Number 1: GRM1555C1H4R7CA01D; Part Description: 4.7pF ±0.25pF 50V Ceramic Capacitor C0G, NP0 0402 (1005 Metric); Capacitance Tolerance: ± 0.25; Voltage Rating: 50; Dielectric Characteristic: C0G / NP0; Ceramic Capacitor Case: 0402 [1005 Metric]; Capacitance: 4.7; SVHC: No SVHC (15-Jun-2015; Product Range: GRM Series; Value: 4.7pF, 50V; Supplier 1: Farnell; Supplier Part Number 1: 2434644; Operating Temperature Max: 125; Operating Temperature Min: -55; MSL: MSL 1 - Unlimited; RoHS: YES; Packaging: Cut Tape
C581 C588 = Cap_0402: Manufacturer: Yageo; Manufacturer Part Number 1: CC0402JRNPO9BN220; Part Description: 22pF ±5% 50V C0G, NP0 Ceramic Capacitor -55°C ~ 125°C Surface Mount, MLCC 0402 (1005 Metric) 0.039" L x 0.020" W (1.00mm x 0.50mm); Tolerance: ±5%; Temperature Coefficient: C0G, NP0; Value: 22pF, 50V; Supplier 1: Digi-Key; Supplier Part Number 1: 311-1018-2-ND; Category: Capacitors; Voltage - Rated: 50V; Packaging: Tape & Reel (TR); RoHS: RoHS Compliant; Capacitance: 22pF; Operating Temperature: -55°C ~ 125°C; Mounting Type: Surface Mount, MLCC; Height - Seated (Max): -; Size / Dimension: 0.039" L x 0.020" W (1.00mm x 0.50mm); Ratings: -; Applications: General Purpose; Thickness (Max): 0.022" (0.55mm); Lead Spacing: -; Lead Style: -; Features: -; Package / Case: 0402 (1005 Metric)
C583 C590 = Cap_0603: as C530 on sheet 22_LMS2_TX_BB_DACs; Value: 10uF, 16V; Supplier 1: Digi-Key; Supplier Part Number 1: 490-7201-2-ND; Category: Capacitors; Ratings: -; Features: -; Lead Style: -; Package / Case: 0603 (1608 Metric); Lead Spacing: -; Applications: General Purpose; Voltage - Rated: 16V; Operating Temperature: -55°C ~ 85°C; Thickness (Max): 0.039" (1.00mm); Mounting Type: Surface Mount, MLCC; RoHS: RoHS Compliant; Size / Dimension: 0.063" L x 0.031" W (1.60mm x 0.80mm); Packaging: Tape & Reel (TR); Height - Seated (Max): -
C584 C585 C591 C592 = Cap_0603: Manufacturer Part Number 1: GRM155R71C104KA88D; Part Description: 0.10µF ±10% 16V X7R Ceramic Capacitor -55°C ~ 125°C Surface Mount, MLCC 0402 (1005 Metric) 0.039" L x 0.020" W (1.00mm x 0.50mm); Brand: Murata Electronics; Tolerance: 10 %; Type: General Purpose MLCC; Capacitance: 0.1 uF; Temperature Coefficient / Code: +/- 15 %; Case Height: 0.5 mm; Case Length: 1 mm; Dielectric: X7R; Supplier 1: Mouser; Supplier Part Number 1: 81-GRM155R71C104KA88; Case Code - in: 0402; Manufacturer: Murata Electronics; Category: Multilayer Ceramic Capacitors MLCC - SMD/SMT; Voltage Rating DC: 16 V; Value: 100nF, 16V; Case Code - mm: 1005; Case Width: 0.5 mm; Maximum Operating Temperature: + 125 C; Minimum Operating Temperature: - 55 C; Minimum Order Quantity: 1; Operating Temperature Range: - 55 C to + 125 C; Package / Case: 0402 (1005 metric); Packaging: Reel; Product: General Type MLCCs; Product Category: Low & Medium Capacitance SMD Ceramic Chip Capacitors; Reeling: True; RoHS - Mouser: Y; RoHS: RoHS Compliant; Series: GRM; Standard Pack Qty: 10000; Termination Style: SMD/SMT
C593 C596 C597 C603 C604 = Cap_0603: as C526 on sheet 22_LMS2_TX_BB_DACs; Supplier 1: Mouser; Supplier Part Number 1: 810-C1608X5R1A226M; Package / Case: 0603 (1608 metric); Category: Multilayer Ceramic Capacitors MLCC - SMD/SMT; Capacitance: 22uF; Operating Temperature Range: - 55 C to + 85 C; Case Code - in: 0603; Voltage Rating DC: 10 V; Case Code - mm: 1608; Value: 22uF, 10V
C598 C605 = Cap_0603: Manufacturer Part Number 1: CC0603MRX5R5BB106; Part Description: 10µF ±20% 6.3V X5R Ceramic Capacitor -55°C ~ 85°C Surface Mount, MLCC 0603 (1608 Metric) 0.063" L x 0.031" W (1.60mm x 0.80mm); Manufacturer: Yageo; Capacitance: 10µF; Tolerance: ±20%; Supplier 1: Digi-Key; Supplier Part Number 1: 311-1448-2-ND; Package / Case: 0603 (1608 Metric); Category: Capacitors; Voltage - Rated: 6.3V; Value: 10uF, 6.3V
FR115 = Ferrite: as FR105-FR114 on sheet 22_LMS2_TX_BB_DACs; Supplier 1: Digi-Key; Supplier Part Number 1: 445-2206-2-ND; Mounting Type: Surface Mount; RoHS: RoHS Compliant; Height (Max): 0.041" (1.05mm); Packaging: Tape & Reel (TR); Category: Filters; Current Rating: 2A; Package / Case: 0805 (2012 Metric); Size / Dimension: 0.079" L x 0.049" W (2.00mm x 1.25mm); Value: 600R, 2A
FR116 FR117 = Ferrite: Manufacturer Part Number 1: MPZ2012S601AT000; Manufacturer: TDK Corporation; Part Description: FERRITE BEAD 600 OHM 0805 1LN; DC Resistance (DCR): 100 mOhm Max; Filter Type: Differential Mode - Single; Impedance @ Frequency: 600 Ohm @ 100MHz; Supplier 1: Digi-Key; Supplier Part Number 1: 445-2206-2-ND; Value: 600R, 2A; Category: Filters; Current Rating: 2A; Height (Max): 0.041" (1.05mm); Mounting Type: Surface Mount; Package / Case: 0805 (2012 Metric); Packaging: Tape & Reel (TR); RoHS: RoHS Compliant; Size / Dimension: 0.079" L x 0.049" W (2.00mm x 1.25mm)
IC46 = ADS4246IRGCR: 14-Bit 160 MSPS Dual Low Power ADC, -40 to 85 degC, 64-pin QFN (RGC64), Green (RoHS & no Sb/Br); Manufacturer: Texas Instruments; Manufacturer Part Number 1: ADS4246IRGCT; Part Description: 14 Bit Analog to Digital Converter 2 Input 2 Pipelined 64-VQFN (9x9); Number of Bits: 14; Sampling Rate (Per Second): 160M; Number of Inputs: 2; Input Type: Differential; Data Interface: LVDS - Parallel, Parallel; Configuration: S/H-ADC; Ratio - S/H:ADC: 1:1; Architecture: Pipelined; Reference Type: Internal; Voltage - Supply, Analog: 1.7 V ~ 1.9 V; Supplier 1: Digi-Key; Supplier Part Number 1: 296-28772-1-ND; RoHS: RoHS Compliant; Category: Integrated Circuits (ICs); Stock 1: 83; Pricing 1: 1=95.91, 10=90.96, 100=82.2967 (USD); Packaging: Cut Tape (CT); Part Status: Active; Number of A/D Converters: 2; Voltage - Supply, Digital: 1.7 V ~ 1.9 V; Features: Simultaneous Sampling; Operating Temperature: -40°C ~ 85°C; Package / Case: 64-VFQFN Exposed Pad; Supplier Device Package: 64-VQFN (9x9); ComponentLink1URL: http://www.ti.com/lit/ds/symlink/ads4246.pdf; ComponentLink1Description: http://www.ti.com/lit/ds/symlink/ads4246.pdf
IC47 = ADA4930-2: Manufacturer: Analog Devices Inc.; Manufacturer Part Number 1: ADA4930-2YCPZ-R7; Part Description: Differential Amplifier 2 Circuit Differential 24-LFCSP-WQ (4x4); Amplifier Type: Differential; Voltage - Supply, Single/Dual (±): 3.3V, 5V; Number of Circuits: 2; Current - Supply: 34mA; Slew Rate: 3400 V/µs; Voltage - Input Offset: 150µV; Current - Input Bias: 23µA; -3db Bandwidth: 1.35GHz; Current - Output / Channel: 30mA; Supplier 1: Digi-Key; Mounting Type: Surface Mount; Gain Bandwidth Product: -; Supplier Device Package: 24-LFCSP-VQ (4x4); Category: Integrated Circuits (ICs); Operating Temperature: -40°C ~ 105°C; Packaging: Cut Tape (CT); RoHS: RoHS Compliant; Package / Case: 24-VFQFN Exposed Pad, CSP; Output Type: Differential; Supplier Part Number 1: ADA4930-2YCPZ-R7CT-ND
R270 R276 R281 R286 = Res_0402: Manufacturer: Vishay Dale; Part Description: RES SMD 300 OHM 1% 1/16W 0402; Manufacturer Part Number 1: CRCW0402300RFKED; Resistance (Ohms): 300; Temperature Coefficient: ±100ppm/°C; Power (Watts): 0.063W, 1/16W; Value: 300R, 1%; Supplier 1: Digi-Key; Supplier Device Package: 0402 (1005 Metric); Composition: Thick Film; Features: Automotive AEC-Q200; Packaging: Cut Tape (CT); Size / Dimension: 0.039" L x 0.020" W (1.00mm x 0.50mm); Category: Resistors; Package / Case: 0402 (1005 Metric); Supplier Part Number 1: 541-300LCT-ND; Number of Terminations: 2; Tolerance: ±1%; Height: 0.016" (0.40mm); Operating Temperature: -55°C ~ 155°C; RoHS: RoHS Compliant
R271 = Res_0402: Manufacturer Part Number 1: RMCF0402FT100R; Part Description: RES SMD 100 OHM 1% 1/16W 0402; Manufacturer: Stackpole Electronics Inc.; Temperature Coefficient: ±100ppm/°C; Supplier 1: Digi-Key; Supplier Part Number 1: RMCF0402FT100RDKR-ND; Package / Case: 0402 (1005 Metric); Composition: Thick Film; Category: Resistors; Tolerance: ±1%; Value: 100R, 1%
R272 R277 R282 R287 = Res_0402: Manufacturer: Vishay Dale; Part Description: RES SMD 560 OHM 1% 1/16W 0402; Manufacturer Part Number 1: CRCW0402560RFKED; Resistance (Ohms): 560; Temperature Coefficient: ±100ppm/°C; Power (Watts): 0.063W, 1/16W; Value: 560R, 1%; Supplier Device Package: 0402 (1005 Metric); Composition: Thick Film; Packaging: Cut Tape (CT); Number of Terminations: 2; Operating Temperature: -55°C ~ 155°C; Supplier Part Number 1: 541-560LCT-ND; Supplier 1: Digi-Key; Category: Resistors; Height: 0.016" (0.40mm); Features: Automotive AEC-Q200; Size / Dimension: 0.039" L x 0.020" W (1.00mm x 0.50mm); Tolerance: ±1%; Package / Case: 0402 (1005 Metric); RoHS: RoHS Compliant
R273 R283 = Res_0402: Manufacturer: Yageo; Manufacturer Part Number 1: RC0402FR-07120RL; Part Description: 120 Ohms ±1% 0.063W, 1/16W Chip Resistor 0402 (1005 Metric) Moisture Resistant Thick Film; Power Rating: 62.5mW; Voltage Rating: 50V; Temperature Coefficient: 100ppm/°C; Max Power Dissipation: 63mW; Value: 120R, 1%; Supplier 1: Digi-Key; Supplier Part Number 1: 311-120LRCT-ND; Stock 1: 1593308; Pricing 1: 1=0.1, 10=0.016, 100=0.0067, 1000=0.00301, 2500=0.00261, 5000=0.00215 (USD); Case/Package: 0402; Case Code (Imperial): 0402; Case Code (Metric): 1005; Min Operating Temperature: -55°C; Max Operating Temperature: 155°C; Package Quantity: 1; Resistance: 120R; Tolerance: 1%; Packaging: Tape and Reel; Termination: SMD/SMT; Composition: Thick Film; Number of Terminations: 2; Military Standard: Not; Features: Moisture Resistant; Length: 1mm; Height: 0.016inch; Width: 0.02inch; Depth: 0.5mm; REACH SVHC: No SVHC; Lead Free: Lead Free; ComponentLink1URL: http://www.farnell.com/datasheets/1018594.pdf?src-supplier=Element14; ComponentLink1Description: http://www.farnell.com/datasheets/1018594.pdf?src-supplier=Element14; ComponentLink2URL: http://www.mouser.com/ds/2/447/PYu-RC0402_51_RoHS_L_6_r-8721.pdf?src-supplier=Mouser; ComponentLink2Description: http://www.mouser.com/ds/2/447/PYu-RC0402_51_RoHS_L_6_r-8721.pdf?src-supplier=Mouser; ComponentLink3URL: http://documents.rs-components.com/techlib://itc_doclist_GB.htm?stockno=6185898&src-supplier=RSComponents; ComponentLink3Description: http://documents.rs-components.com/techlib://itc_doclist_GB.htm?stockno=6185898&src-supplier=RSComponents; ComponentLink4URL: http://www.yageo.com/documents/recent/PYu-RC_Group_51_RoHS_L_10.pdf?src-supplier=Digi-Key; ComponentLink4Description: http://www.yageo.com/documents/recent/PYu-RC_Group_51_RoHS_L_10.pdf?src-supplier=Digi-Key; ComponentLink5URL: http://www.yageo.com/documents/recent/PYu-RC0402_51_RoHS_L_6_r.pdf?src-supplier=Future+Electronics; ComponentLink5Description: http://www.yageo.com/documents/recent/PYu-RC0402_51_RoHS_L_6_r.pdf?src-supplier=Future+Electronics
R274 R278 R284 R288 = Res_0402: Manufacturer: Yageo; Manufacturer Part Number 1: RC0402FR-0739RL; Part Description: 39 Ohms ±1% 0.063W, 1/16W Chip Resistor 0402 (1005 Metric) Moisture Resistant Thick Film; Power Rating: 63mW; Voltage Rating: 50V; Temperature Coefficient: 100ppm/°C; Value: 39R, 1%; ComponentLink1URL: http://www.yageo.com.tw/exep/pages/download/literatures/PYu-R_INT-thick_7.pdf?src-supplier=Digi-Key; ComponentLink1Description: http://www.yageo.com.tw/exep/pages/download/literatures/PYu-R_INT-thick_7.pdf?src-supplier=Digi-Key; ComponentLink2URL: http://www.yageo.com/NewPortal/yageodocoutput?fileName=/pdf/R-Chip/PYu-RC_51_RoHS_P_0.pdf&src-supplier=Digi-Key; ComponentLink2Description: http://www.yageo.com/NewPortal/yageodocoutput?fileName=/pdf/R-Chip/PYu-RC_51_RoHS_P_0.pdf&src-supplier=Digi-Key; Supplier 1: Digi-Key; Supplier Part Number 1: 311-39.0LRCT-ND; Stock 1: 1060646; Pricing 1: 1=0,10000, 10=0,01600, 100=0,00660, 1000=0,00299, 2500=0,00259, 5000=0,00214 (USD); RoHS: Yes; Case/Package: 0402; Case Code (Imperial): 0402; Case Code (Metric): 1005; Weight: 2.3E-05oz; Contact Plating: Tin,Matte; Min Operating Temperature: -55°C; Max Operating Temperature: 155°C; Tolerance: 1%; Package Quantity: 1; Packaging: Tape and Reel; Features: Moisture Resistant; Resistance: 39R; Termination: SMD/SMT; Resistor Type: Thick Film; Number of Terminations: 2; Max Power Dissipation: 63mW; Working Voltage: 50V; Series: RC; Resistance Tolerance: 1%; Construction: Rectangular; Technology: THICK FILM; Length: 1mm; Width: 0.5mm; Height: 0.016inch; Depth: 0.5mm; Radiation Hardening: No; Lead Free: Lead Free; REACH SVHC: Unknown; Military Standard: Not; RoHS Compliant: Yes; ComponentLink3URL: https://datasheet.ciiva.com/11819/0900766b80c66297-11819479.pdf?src-supplier=RSComponents; ComponentLink3Description: https://datasheet.ciiva.com/11819/0900766b80c66297-11819479.pdf?src-supplier=RSComponents; ComponentLink4URL: https://datasheet.ciiva.com/2519/pyu-r-int-thick-7-2519001.pdf?src-supplier=Digi-Key; ComponentLink4Description: https://datasheet.ciiva.com/2519/pyu-r-int-thick-7-2519001.pdf?src-supplier=Digi-Key; ComponentLink5URL: https://datasheet.ciiva.com/2519/pyu-r-int-thick-7-2519002.pdf?src-supplier=Digi-Key; ComponentLink5Description: https://datasheet.ciiva.com/2519/pyu-r-int-thick-7-2519002.pdf?src-supplier=Digi-Key; ComponentLink6URL: https://datasheet.ciiva.com/2519/pyu-r-int-thick-7-2519000.pdf?src-supplier=Digi-Key; ComponentLink6Description: https://datasheet.ciiva.com/2519/pyu-r-int-thick-7-2519000.pdf?src-supplier=Digi-Key; ComponentLink7URL: https://datasheet.ciiva.com/7849/1018594-7849983.pdf?src-supplier=Element14; ComponentLink7Description: https://datasheet.ciiva.com/7849/1018594-7849983.pdf?src-supplier=Element14; ComponentLink8URL: https://datasheet.ciiva.com/7849/1018594-7849982.pdf?src-supplier=Element14; ComponentLink8Description: https://datasheet.ciiva.com/7849/1018594-7849982.pdf?src-supplier=Element14; ComponentLink9URL: https://datasheet.ciiva.com/8889/pyu-rc0402-51-rohs-l-6-8889306.pdf?src-supplier=Avnet; ComponentLink9Description: https://datasheet.ciiva.com/8889/pyu-rc0402-51-rohs-l-6-8889306.pdf?src-supplier=Avnet; ComponentLink10URL: https://datasheet.ciiva.com/16741/pyu-rc0402-51-rohs-l-6-r-16741016.pdf?src-supplier=Future+Electronics; ComponentLink10Description: https://datasheet.ciiva.com/16741/pyu-rc0402-51-rohs-l-6-r-16741016.pdf?src-supplier=Future+Electronics; ComponentLink11URL: https://datasheet.ciiva.com/15189/getdatasheetpartid-325130-15189445.pdf?src-supplier=Verical; ComponentLink11Description: https://datasheet.ciiva.com/15189/getdatasheetpartid-325130-15189445.pdf?src-supplier=Verical
R275 R279 R285 R289 = Res_0402: Manufacturer 1: Yageo; Manufacturer Part Number 1: RC0402FR-0710RP; Part Description: 10 Ohms ±1% 0.063W, 1/16W Chip Resistor 0402 (1005 Metric) - Thick Film; Temperature Coefficient: 350ppm/°C; Max Power Dissipation: 63mW; Value: 10R, 1%; Supplier 1: Digi-Key; Supplier Part Number 1: YAG1250CT-ND; Stock 1: 35341; Pricing 1: 1=0,10000, 10=0,04200, 100=0,01700, 1000=0,00765, 2500=0,00664, 5000=0,00548 (USD); RoHS: Yes; Case/Package: 0402; Case Code (Metric): 1005; Case Code (Imperial): 0402; Min Operating Temperature: -55°C; Max Operating Temperature: 155°C; Packaging: Tape and Reel; Resistance: 10R; Resistor Type: Thick Film; Number of Terminations: 2; Tolerance: 1%; Features: Moisture Resistant; Length: 0.039inch; Width: 0.02inch; Height: 0.016inch; RoHS Compliant: Yes; ComponentLink1URL: http://www.yageo.com.tw/exep/pages/download/literatures/PYu-R_INT-thick_7.pdf?src-supplier=Digi-Key; ComponentLink1Description: http://www.yageo.com.tw/exep/pages/download/literatures/PYu-R_INT-thick_7.pdf?src-supplier=Digi-Key; ComponentLink2URL: http://www.yageo.com/NewPortal/yageodocoutput?fileName=/pdf/R-Chip/PYu-RC_51_RoHS_P_0.pdf&src-supplier=Digi-Key; ComponentLink2Description: http://www.yageo.com/NewPortal/yageodocoutput?fileName=/pdf/R-Chip/PYu-RC_51_RoHS_P_0.pdf&src-supplier=Digi-Key
R280 R290 R292 R294 = Res_0402: Manufacturer: Yageo; Manufacturer Part Number 1: RC0402FR-0710KL; Part Description: RES SMD 10K OHM 1% 1/16W 0402; Temperature Coefficient: ±100ppm/°C; Power (Watts): 0.063W, 1/16W; Value: 10k, 1%; Supplier 1: Digi-Key; Supplier Part Number 1: 311-10.0KLRTR-ND; Resistance (Ohms): 10k; Packaging: Tape & Reel (TR); RoHS: RoHS Compliant; Package / Case: 0402 (1005 Metric); Tolerance: ±1%; Operating Temperature: -55°C ~ 155°C; Size / Dimension: 0.039" L x 0.020" W (1.00mm x 0.50mm); Number of Terminations: 2; Category: Resistors; Height: 0.016" (0.40mm); Supplier Device Package: 0402; Features: Moisture Resistant; Composition: Thick Film
R291 R293 R295 = Res_0402: Manufacturer: Yageo; Part Description: RES SMD 0.0OHM JUMPER 1/16W 0402; Manufacturer Part Number 1: RC0402JR-070RL; Supplier 1: Digi-Key; Supplier Part Number 1: 311-0.0JRTR-ND; Composition: Thick Film; Package / Case: 0402 (1005 Metric); Category: Resistors; Value: 0R
R296 R297 = Res_0402: as R246 on sheet 22_LMS2_TX_BB_DACs; Value: 0R; Supplier 1: Digi-Key; Supplier Part Number 1: 311-0.0JRTR-ND; Category: Resistors; Temperature Coefficient: -; Features: Moisture Resistant; Supplier Device Package: 0402; Height: 0.016" (0.40mm); Package / Case: 0402 (1005 Metric); Operating Temperature: -55°C ~ 155°C; Size / Dimension: 0.039" L x 0.020" W (1.00mm x 0.50mm); Composition: Thick Film; Packaging: Tape & Reel (TR); Number of Terminations: 2; RoHS: RoHS Compliant